# Altium project MAX96717_EVB_revC.PrjPcb
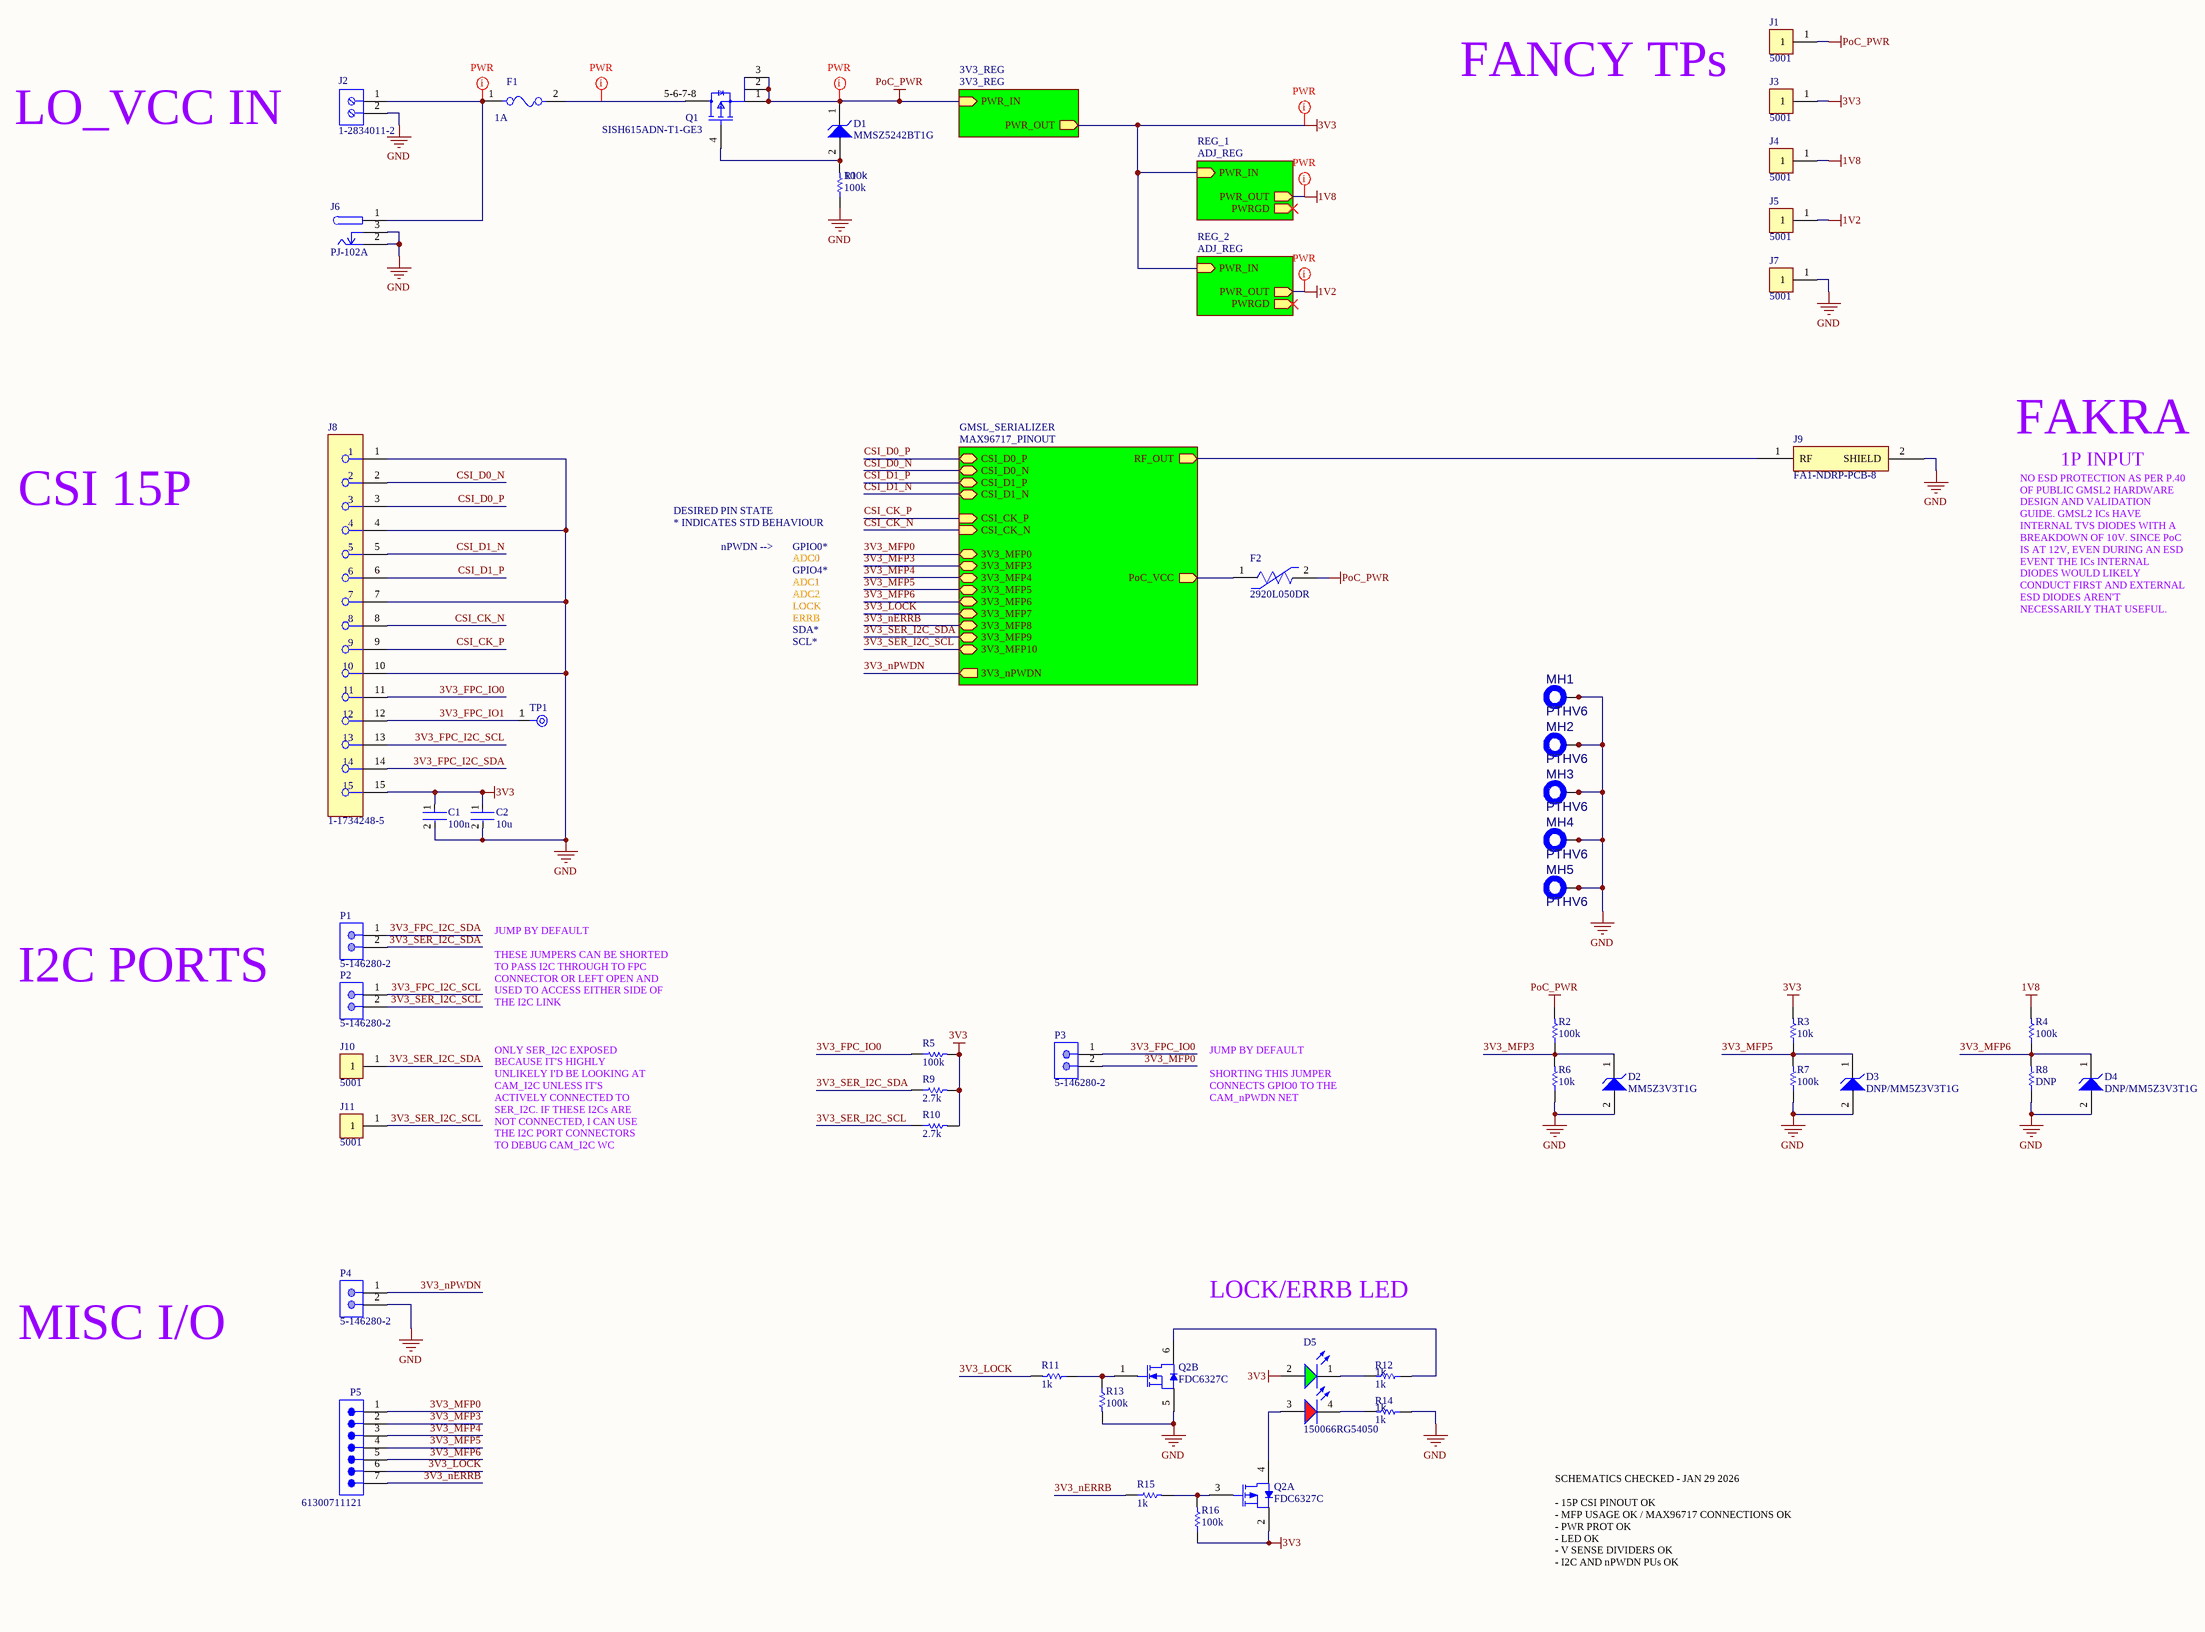
[diagram p0: MAX96717_EVB_revC.SchDoc]
4 sheets, 104 parts. Net scope: hierarchical (ports join the sheet entries above them; power ports are global).
Board file: MAX96717_EVB_revC.PcbDoc
Sheets:
  MAX96717_EVB_revC.SchDoc
    GMSL_SERIALIZER = MAX96717_PINOUT.SchDoc
    3V3_REG = 3V3_REG.SchDoc
    REG_1 = ADJ_REG.SchDoc
    REG_2 = ADJ_REG.SchDoc

## Sheet MAX96717_EVB_revC.SchDoc
size C; SheetNumber: 1; SheetTotal: 4

### Parts
C1  100n  [FP-0402-L_1_0_0_05-W_0_5-IPC_A]
C2  10u  [FP-0402-L_1_0_0_05-W_0_5-IPC_A]
D1  MMSZ5242BT1G  [ONSC-SOD-123-2-425-04_V]
D2  MM5Z3V3T1G  [ONSC-SOD-523-2-502-01_V]
D3  DNP/MM5Z3V3T1G  [ONSC-SOD-523-2-502-01_V]
D4  DNP/MM5Z3V3T1G  [ONSC-SOD-523-2-502-01_V]
D5  150066RG54050  [WL-SBCD_0606]
F1  1A  [FP-SF-1206FP-MFG]
F2  2920L050DR  [FP-2920L050DR-MFG]
J1  5001  [FP-5001-MFG]
J2  1-2834011-2  [1-2834011-2-Footprint-1]
J3  5001  [FP-5001-MFG]
J4  5001  [FP-5001-MFG]
J5  5001  [FP-5001-MFG]
J6  PJ-102A  [FP-PJ-102A-MFG]
J7  5001  [FP-5001-MFG]
J8  1-1734248-5  [FP-1-1734248-5-MFG]
J9  FA1-NDRP-PCB-8  [FA1-NDRP-PCB-8-Footprint-1]
J10  5001  [FP-5001-MFG]
J11  5001  [FP-5001-MFG]
MH1  PTHV6  [PTHV6 M2]  (net tie, no BOM)
MH2  PTHV6  [PTHV6 M2]  (net tie, no BOM)
MH3  PTHV6  [PTHV6 M2]  (net tie, no BOM)
MH4  PTHV6  [PTHV6 M2]  (net tie, no BOM)
MH5  PTHV6  [PTHV6 M2]  (net tie, no BOM)
P1  5-146280-2  [TECO-5-146280-2_V]
P2  5-146280-2  [TECO-5-146280-2_V]
P3  5-146280-2  [TECO-5-146280-2_V]
P4  5-146280-2  [TECO-5-146280-2_V]
P5  61300711121  [61300711121]
Q1  SISH615ADN-T1-GE3  [SISH615ADN-T1-GE3-Footprint-1]
Q2  FDC6327C  [FAIR-SOT23-6_V]  (parts A,B of 2)
R1  100k  [R0603B]
R2  100k  [R0603B]
R3  10k  [R0603B]
R4  100k  [R0603B]
R5  100k  [R0603B]
R6  10k  [R0603B]
R7  100k  [R0603B]
R8  DNP  [R0603B]
R9  2.7k  [R0603B]
R10  2.7k  [R0603B]
R11  1k  [R0603B]
R12  1k  [R0603B]
R13  100k  [R0603B]
R14  1k  [R0603B]
R15  1k  [R0603B]
R16  100k  [R0603B]
TP1  TPAD6R  [New footprint 1]  (value not drawn)  (no BOM)

### Sub-sheets
3V3_REG = 3V3_REG: PWR_IN (in), PWR_OUT (out)
GMSL_SERIALIZER = MAX96717_PINOUT: CSI_D0_P (bidir), CSI_D0_N (bidir), CSI_D1_P (bidir), CSI_D1_N (bidir), CSI_CK_P (in), CSI_CK_N (in), RF_OUT (out), PoC_VCC (out), 3V3_MFP0 (bidir), 3V3_MFP3 (bidir), 3V3_MFP4 (bidir), 3V3_MFP5 (bidir), 3V3_MFP6 (bidir), 3V3_MFP7 (bidir), 3V3_MFP8 (bidir), 3V3_MFP9 (bidir), 3V3_MFP10 (bidir), 3V3_nPWDN (out)
REG_1 = ADJ_REG: PWR_OUT (out), PWR_IN (in), PWRGD (out)
REG_2 = ADJ_REG: PWR_OUT (out), PWR_IN (in), PWRGD (out)

### Nets
1V2: J5.1 ; sheet REG_2/PWR_OUT
1V8: J4.1 R4.2 ; sheet REG_1/PWR_OUT
3V3: C1.1 C2.1 D5.2(A) J3.1 J8.15 Q2.2(S) R3.2 R5.2 R9.2 R10.2 R16.1 ; sheet 3V3_REG/PWR_OUT, sheet REG_1/PWR_IN, sheet REG_2/PWR_IN
GND: C1.2 C2.2 D2.2(A) D3.2(A) D4.2(A) J2.2 J6.2 J6.3 J7.1 J8.1 J8.4 J8.7 J8.10 J9.2(SHIELD) MH1.1(MH) MH1.2(V1) MH1.3(V2) MH1.4(V3) MH1.5(V4) MH1.6(V5) MH1.7(V6) MH2.1(MH) MH2.2(V1) MH2.3(V2) MH2.4(V3) MH2.5(V4) MH2.6(V5) MH2.7(V6) MH3.1(MH) MH3.2(V1) MH3.3(V2) MH3.4(V3) MH3.5(V4) MH3.6(V5) MH3.7(V6) MH4.1(MH) MH4.2(V1) MH4.3(V2) MH4.4(V3) MH4.5(V4) MH4.6(V5) MH4.7(V6) MH5.1(MH) MH5.2(V1) MH5.3(V2) MH5.4(V3) MH5.5(V4) MH5.6(V5) MH5.7(V6) P4.2 Q2.5(S) R1.1 R6.1 R7.1 R8.1 R13.2 R14.1
PoC_PWR: D1.1(K) F2.2 J1.1 Q1.1(S) Q1.2(S) Q1.3(S) R2.2 ; sheet 3V3_REG/PWR_IN
3V3_FPC_I2C_SCL: J8.13 P2.1
3V3_FPC_I2C_SDA: J8.14 P1.1
3V3_FPC_IO0: J8.11 P3.1 R5.1
3V3_FPC_IO1: J8.12 TP1.1(TP)
3V3_LOCK: P5.6 R11.2 ; sheet GMSL_SERIALIZER/3V3_MFP7
3V3_MFP0: P3.2 P5.1 ; sheet GMSL_SERIALIZER/3V3_MFP0
3V3_MFP3: D2.1(K) P5.2 R2.1 R6.2 ; sheet GMSL_SERIALIZER/3V3_MFP3
3V3_MFP4: P5.3 ; sheet GMSL_SERIALIZER/3V3_MFP4
3V3_MFP5: D3.1(K) P5.4 R3.1 R7.2 ; sheet GMSL_SERIALIZER/3V3_MFP5
3V3_MFP6: D4.1(K) P5.5 R4.1 R8.2 ; sheet GMSL_SERIALIZER/3V3_MFP6
3V3_nERRB: P5.7 R15.1 ; sheet GMSL_SERIALIZER/3V3_MFP8
3V3_nPWDN: P4.1 ; sheet GMSL_SERIALIZER/3V3_nPWDN
3V3_SER_I2C_SCL: J11.1 P2.2 R10.1 ; sheet GMSL_SERIALIZER/3V3_MFP10
3V3_SER_I2C_SDA: J10.1 P1.2 R9.1 ; sheet GMSL_SERIALIZER/3V3_MFP9
CSI_CK_N: J8.8 ; sheet GMSL_SERIALIZER/CSI_CK_N
CSI_CK_P: J8.9 ; sheet GMSL_SERIALIZER/CSI_CK_P
CSI_D0_N: J8.2 ; sheet GMSL_SERIALIZER/CSI_D0_N
CSI_D0_P: J8.3 ; sheet GMSL_SERIALIZER/CSI_D0_P
CSI_D1_N: J8.5 ; sheet GMSL_SERIALIZER/CSI_D1_N
CSI_D1_P: J8.6 ; sheet GMSL_SERIALIZER/CSI_D1_P
RF_OUT: J9.1(RF) ; sheet GMSL_SERIALIZER/RF_OUT
NetD1_2: D1.2(A) Q1.4(G) R1.2
NetD5_1: D5.1(K) R12.2
NetD5_3: D5.3(A) Q2.4(D)
NetD5_4: D5.4(K) R14.2
NetF1_1: F1.1 J2.1 J6.1
NetF1_2: F1.2 Q1.5-6-7-8(D)
NetF2_1: F2.1 ; sheet GMSL_SERIALIZER/PoC_VCC
NetQ2_1: Q2.1(G) R11.1 R13.1
NetQ2_3: Q2.3(G) R15.2 R16.2
NetQ2_6: Q2.6(D) R12.1

### Layout directives
net class PWR: 1V2, 1V8, 3V3, NetF1_1, NetF1_2, PoC_PWR

### Notes on the sheet
- FANCY TPs
- LO_VCC IN
- FAKRA
- 1P INPUT
- CSI 15P
- DESIRED PIN STATE
- * INDICATES STD BEHAVIOUR
- nPWDN -->
- GPIO0*
- ADC0
- GPIO4*
- ADC1
- ADC2
- LOCK
- ERRB
- SDA*
- SCL*
- NO ESD PROTECTION AS PER P.40 OF PUBLIC GMSL2 HARDWARE DESIGN AND VALIDATION GUIDE. GMSL2 ICs HAVE INTERNAL TVS DIODES WITH A BREAKDOWN OF 10V. SINCE PoC IS AT 12V, EVEN DURING AN ESD EVENT THE ICs INTERNAL DIODES WOULD LIKELY CONDUCT FIRST AND EXTERNAL ESD DIODES AREN'T NECESSARILY THAT USEFUL.
- I2C PORTS
- JUMP BY DEFAULT
  THESE JUMPERS CAN BE SHORTED TO PASS I2C THROUGH TO FPC CONNECTOR OR LEFT OPEN AND USED TO ACCESS EITHER SIDE OF THE I2C LINK
- JUMP BY DEFAULT
  SHORTING THIS JUMPER CONNECTS GPIO0 TO THE CAM_nPWDN NET
- ONLY SER_I2C EXPOSED BECAUSE IT'S HIGHLY UNLIKELY I'D BE LOOKING AT CAM_I2C UNLESS IT'S ACTIVELY CONNECTED TO SER_I2C. IF THESE I2Cs ARE NOT CONNECTED, I CAN USE THE I2C PORT CONNECTORS TO DEBUG CAM_I2C WC
- LOCK/ERRB LED
- MISC I/O
- SCHEMATICS CHECKED - JAN 29 2026
  - 15P CSI PINOUT OK
  - MFP USAGE OK / MAX96717 CONNECTIONS OK
  - PWR PROT OK
  - LED OK
  - V SENSE DIVIDERS OK
  - I2C AND nPWDN PUs OK

### Library data of the parts
C1 C2 = CMP-001-00058-1: LARGE PADS, 0402 CAP, CHANGE COMMENT TO MATCH REAL P/N; Capacitor Type: Ceramic; Min Operating Temperature: -55°C; Mounting Technology: Surface Mount; Pins: 2; Case/Package: 0402; RoHS Compliant: Yes; Max Operating Temperature: 85°C
D1 = CMP-1060-00565-1: Zener Voltage Regulator, 500 mW, 2-Pin SOD-123, Pb-Free, Tape and Reel; Manufacturer: On Semiconductor; P Max (W): 0.5; VZ Typ (V): 12; PartNumber: MMSZ5242BT1G; PackageReference: SOD-123-2-425-04; ComponentLink3URL: http://www.onsemi.com/pub_link/Collateral/425-04.PDF; Mounting Technology: Surface Mount; ComponentLink2Description: Datasheet; ComponentLink1URL: http://www.onsemi.com/; ComponentLink3Description: Package Specification; PackageDescription: 2-Pin SOD, Body 1.6 x 2.69 mm; PackageVersion: Rev. G, 10/2009; ComponentLink1Description: Manufacturer URL; RoHS: Pb-Free; ComponentLink2URL: http://www.onsemi.com/pub_link/Collateral/MMSZ5221BT1-D.PDF; Packing: Tape and Reel; DatasheetVersion: Rev. 12
D2-D4 = CMP-1060-00750-1: Zener Voltage Regulator, 500 mW, 2-Pin SOD-523, Pb-Free, Tape and Reel; Manufacturer: On Semiconductor; P Max (W): 0.5; VZ Typ (V): 3.3; RoHS: Pb-Free; ComponentLink2Description: Datasheet; PackageReference: SOD-523-2-502-01; DatasheetVersion: Rev. 10; ComponentLink1Description: Manufacturer URL; PackageVersion: Rev. E, 09/2010; ComponentLink3URL: http://www.onsemi.com/pub_link/Collateral/502-01.PDF; ComponentLink2URL: http://www.onsemi.cn/pub_link/Collateral/MM5Z2V4T1-D.PDF; Mounting Technology: Surface Mount; PartNumber: MM5Z3V3T1G; Packing: Tape and Reel; PackageDescription: 2-Pin SOD, Body 1.2 x 0.8 mm; ComponentLink1URL: http://www.onsemi.com/; ComponentLink3Description: Package Specification
D5 = CMP-004-00040-2: Led, Red/Grn, 180Mcd/230Mcd, 624Nm/525Nm Rohs Compliant: Yes; Source: rgled.SchLib; Component Type: Standard; Design Item ID: CMP-004-00034-2; Pins: 4
F1 = CMP-07399-000013-1: FUSE BOARD MOUNT 2A 63VDC 1206; Voltage Rating (DC): 63V; Fuse Type: Board Mount (Cartridge Style Excluded); Approvals: UL; Mount: Surface Mount; Min Operating Temperature: -20°C; Max Operating Temperature: 105°C; Case Code (Imperial): 1206; Packaging: Cut Tape; Current Rating: 2A; RoHS Compliant: Yes; Series: SinglFuse™ SF-1206FP; Case Code (Metric): 3216; Case/Package: 1206
F2 = CMP-08606-000071-1: PTC RESET FUSE 60V 500MA 2920; Resistance: 1.4R; Trip Current: 1A; Power Dissipation: 1.5W; Time to Trip: 4s; Approvals: cULus; Current Rating: 10A; Operating Supply Voltage: 60V; Termination: SMD/SMT; Width: 5.44mm; Case/Package: 2920; Series: 2920L; Case Code (Imperial): 2920; Height: 1.25mm; Hold Current: 500mA; Terminal Material: Copper; Min Operating Temperature: -40°C; Package Quantity: 1500; Max Voltage Rating (DC): 60V; RoHS Compliant: Yes; Case Code (Metric): 7351; Lead Free: Lead Free; Max Operating Temperature: 85°C; Voltage Rating (DC): 60V; Working Voltage: 60V; Length: 7.98mm; REACH SVHC: No SVHC; Max Current Rating: 10A; Voltage Rating: 60V; Packaging: Tape and Reel
J1 J3-J5 J7 J10 J11 = CMP-2000-05181-2: PC TEST POINT MINIATURE BLACK; Body Material: Bronze; Plating: Silver; Inside Diameter: 1.27mm; Hole Diameter: 1.6mm; Number of Ports: 1; Outside Diameter: 2.54mm; Insulation: Insulated; Insulation Material: Nylon; Mount: Through Hole; RoHS Compliant: Yes; Series: THM; Height: 0.3inch; Termination: Through Hole; Material: Nylon; Packaging: Bulk; Contact Material: Bronze; REACH SVHC: No SVHC; Contact Plating: Silver; Orientation: Straight; Lead Free: Lead Free; Package Quantity: 100; Length: 7.62mm; Flammability Rating: UL94 V-0; Number of Contacts: 1; Diameter: 2.54mm; Housing Color: Black; Color: Black
J2 = CMP-002-00067-1: Barrier Strip Terminal Block; RoHS Compliant: Yes
J6 = CMP-12637-106234071-1: PJ-102A 2.0 x 6.5 mm, 2.5 A, Horizontal, Through Hole, Tapered Pins, Dc Power Jack Connector; Voltage Rating (DC): 24V; Number of Contacts: 3; Outside Diameter: 6.5mm; Gender: Male; Shielding: No; Insulation Resistance: 50MΩ; Current Rating: 2.5A; Inside Diameter: 2mm; Number of Conductors: 2; Housing Color: Black; RoHS: Compliant; Diameter: 2.1mm; Mount: Through Hole; Contact Plating: Nickel; NexarPartId: 106234071; Voltage Rating: 24V; Housing Material: Thermoplastic; Max Operating Temperature: 85°C; Color: Black; Contact Material: Copper, Nickel, Tin; Orientation: Horizontal; Packaging: Bulk; Flammability Rating: UL94 V-0; Schedule B: 8536695050, 8536695050; Contact Gender: Male; Lead Free: Lead Free; Termination: Through Hole; Min Operating Temperature: -25°C; Height: 11.2mm; Lifecycle Status: Production
J8 = CMP-03368-000001-1: CONN FPC VERT 15POS 1.00MM SMD; Manufacturer: TE; Conn Orientation: Vertical; Conn Gender: Female; Current Rating: 1A; Is Female: yes; Number Of Contacts: 15; Pitch: 1mm; Voltage Rating: 125V; ComponentLink2URL: https://www.te.com/commerce/DocumentDelivery/DDEController?Action=showdoc&DocId=Customer+Drawing%7F1734248%7FE1%7Fpdf%7FEnglish%7FENG_CD_1734248_E1__.pdf%7F1-1734248-5; Device Class L1: Connectors; Category: Conn; Package: 0; Lead Free: Yes; Digikey Description: CONN FPC VERT 15POS 1.00MM SMD; Height: 8mm; Manufacturer Part Number: 1-1734248-5; Temperature: -20°C to +85°C; Contact Material: Gold,Nickel; Device Class L3: unset; ComponentLink2Description: Datasheet; RoHS: TRUE; Temperature Range Low: -20°C; Octopart: https://octopart.com/1-1734248-5-te+connectivity-40620898; Device Class L2: FFC / FPC; Mouser Description: FFC & FPC Connectors 15P 1.0 FPC, Zip V/T SMT; Automotive: No; Temperature Range High: +85°C; Mounting Type: Surface Mount
J9 = CMP-002-00054-2: RF F Connector, Male, Board Mount, Solder Terminal, Plug; Connector Type: RF F CONNECTOR; RoHS Compliant: Yes; Mounting Technology: Board
MH1-MH5 = CMP-00028-00001-13: Plated mounting hole with 6 peripheral vias. This is a generic symbol that groups all relevant footprints.
P1-P4 = CMP-2000-07492-1: Male Header, Pitch 2.54 mm, 1 x 2 Position, Height 8.21 mm, Tail Length 3.05 mm, -65 to 105 degC, RoHS, Bulk; Manufacturer: TE Connectivity; Mating Connector Lock: No(Without); Number of Positions: 2; Pitch: 2.54mm; PCB Mounting Orientation: Vertical; Keyed: No; Case\/Package: 100; Mating Post Length: 0.23inch; High Temperature Housing: Yes; Max Current Rating: 5A; PCB Thickness: 0.063inch; PCB Mount Retention: Without; Approvals: CSA; Current Rating: 3A; Radiation Hardening: No; Length: 4.67mm; Contact Mating Length: 0.23inch; Connector Type: Header; Number of Rows: 1; Termination Post Length: 0.12inch; Board Standoff: No(Without); Max Operating Temperature: 105degC; Contact Shape: Square; Selectively Loaded: No(Without); Gasket: No(Without); Number of Contacts: 2; Contact Gender: Male; Mating Alignment: No(Without); Manufacturer URL: http://www.te.com/; Datasheet URL: http://www.te.com/commerce/DocumentDelivery/DDEController?Action=showdoc&DocId=Customer+Drawing%7F146280%7FH1%7Fpdf%7FEnglish%7FENG_CD_146280_H1.pdf%7F5-146280-2; Mount: ThroughHole; Orientation: Straight; Packaging: Carton; Package Reference: 5-146280-2; Package Quantity: 500; Stabilizers: No(Without); Row Spacing: 2.54mm; Contact Material: CopperAlloy; Panel Mount Retention: No(Without); Datasheet Version: Rev. H1, 08/2016; Housing Colour: Black; Colour: Black; Package Description: Male Header, Pitch 2.54 mm, 1 x 2 Position, Height 8.21 mm, Tail Length 3.05 mm; Contact Plating: Matte; Housing Material: Polymer; Contact Protection: No(Without); Min Operating Temperature: -65degC; Mounting Technology: ThroughHole; Flammability Rating: UL94V-0; RoHSCompliant: true; Termination: ThroughHole; Depth: 2.34mm; High Speed Serial Data Connector: No
P5 = CMP-1502-01074-4: THT Vertical Pin Header WR-PHD, Pitch 2.54 mm, Single Row, 7 pins; Number of Positions: 7; Pitch: 2.54mm; Gender: Male; Operating Supply Voltage: 250V; Contact Resistance: 20mΩ; Current Rating: 3A; Connector Type: Male Pin; Contact Mating Length: 5.9944mm; Number of Rows: 1; Packaging: Bulk; Contact Material: Copper; Orientation: Vertical; Color: Black; Mount: Through Hole; Termination: Solder; RoHS: Compliant; Lead Pitch: 2.54mm; Contact Plating: Gold; Number of Pins: 7; Number of Contacts: 7
Q1 = CMP-013-00018-2: Trans MOSFET P-CH 20V 22.1A 8-Pin PowerPAK 1212 EP T/R; Source: SISH615ADN-T1-GE3.SchLib; Design Item ID: CMP-013-00036-4; Component Type: Standard; Pins: 5
Q2 = CMP-2000-04939-1: Dual N & P-Channel 2.5 V Specified PowerTrench(TM) MOSFET, -55 to 150 degC, 6-Pin SOT-23, RoHS, Tape and Reel; Manufacturer: Fairchild; Typical Rise Time: 9@NChannel; Rad Hard: No; Maximum Drain Source Voltage: 20V; Typical Fall Time: 3@NChannel; Typical Turn-On Delay Time: 5@NChannel; Maximum Continuous Drain Current: 2.7@NChannel; Typical Turn-Off Delay Time: 12@NChannel; RDS-on: 80@4.5V@NChannel; Channel Mode: Enhancement; Maximum Gate Source Voltage: ±8V; Package Version: Rev. 5, 05/2015; Operating Temperature: -55to150degC; Packaging: Tape&Reel; Package Reference: SOT23-6; Package URL: https://www.fairchildsemi.com/package-drawings/MA/MA06A.pdf; Package Description: 6-Pin Small Outline Transistor, Body 2.9 x 1.6 mm, Pitch 0.95 mm; Manufacturer URL: https://www.fairchildsemi.com/; Channel Type: N; Datasheet Version: Rev. E, 07/2000; Package: 6SuperSOT; Datasheet URL: https://www.fairchildsemi.com/datasheets/FD/FDC6327C.pdf; Mounting: SurfaceMount; Category: MOSFET
R1 R2 R4 R5 R7 R11-R16 = CMP-009-00002-14: Resistor
  R1 R2 R4 R5 R7: Value: 100k
  R12 R14: Value: 1k
R3 R6 R8-R10 = CMP-009-00002-14: Resistor; Value: 100k
TP1 = CMP-00025-3: Test Point .6mm

## Sheet MAX96717_PINOUT.SchDoc
size C; SheetNumber: 4; SheetTotal: 4
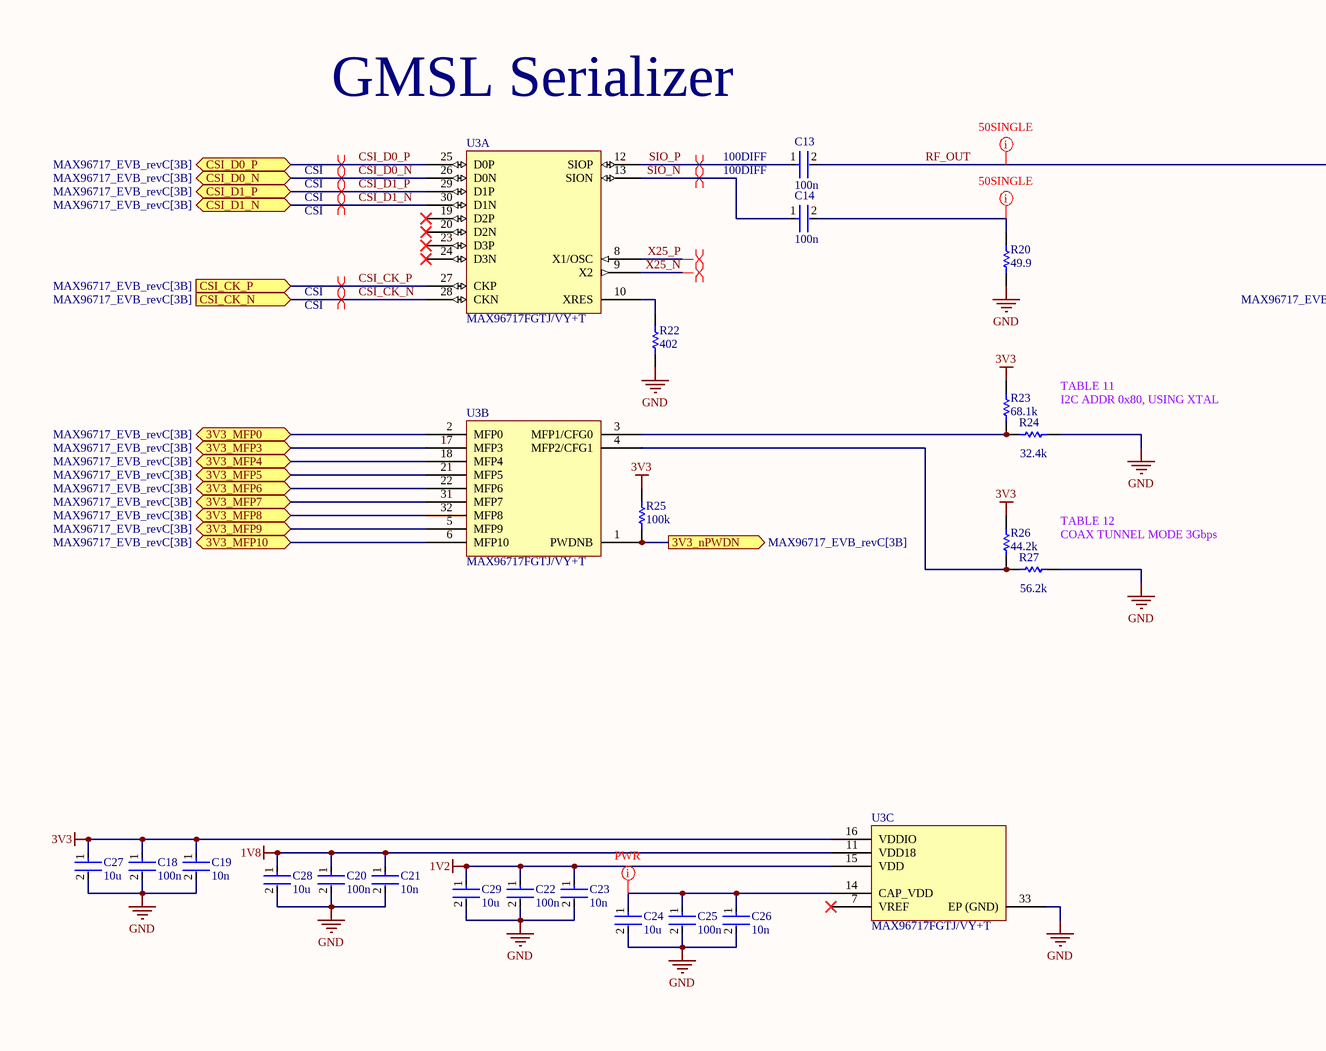
[diagram p1: MAX96717_PINOUT.SchDoc, left]
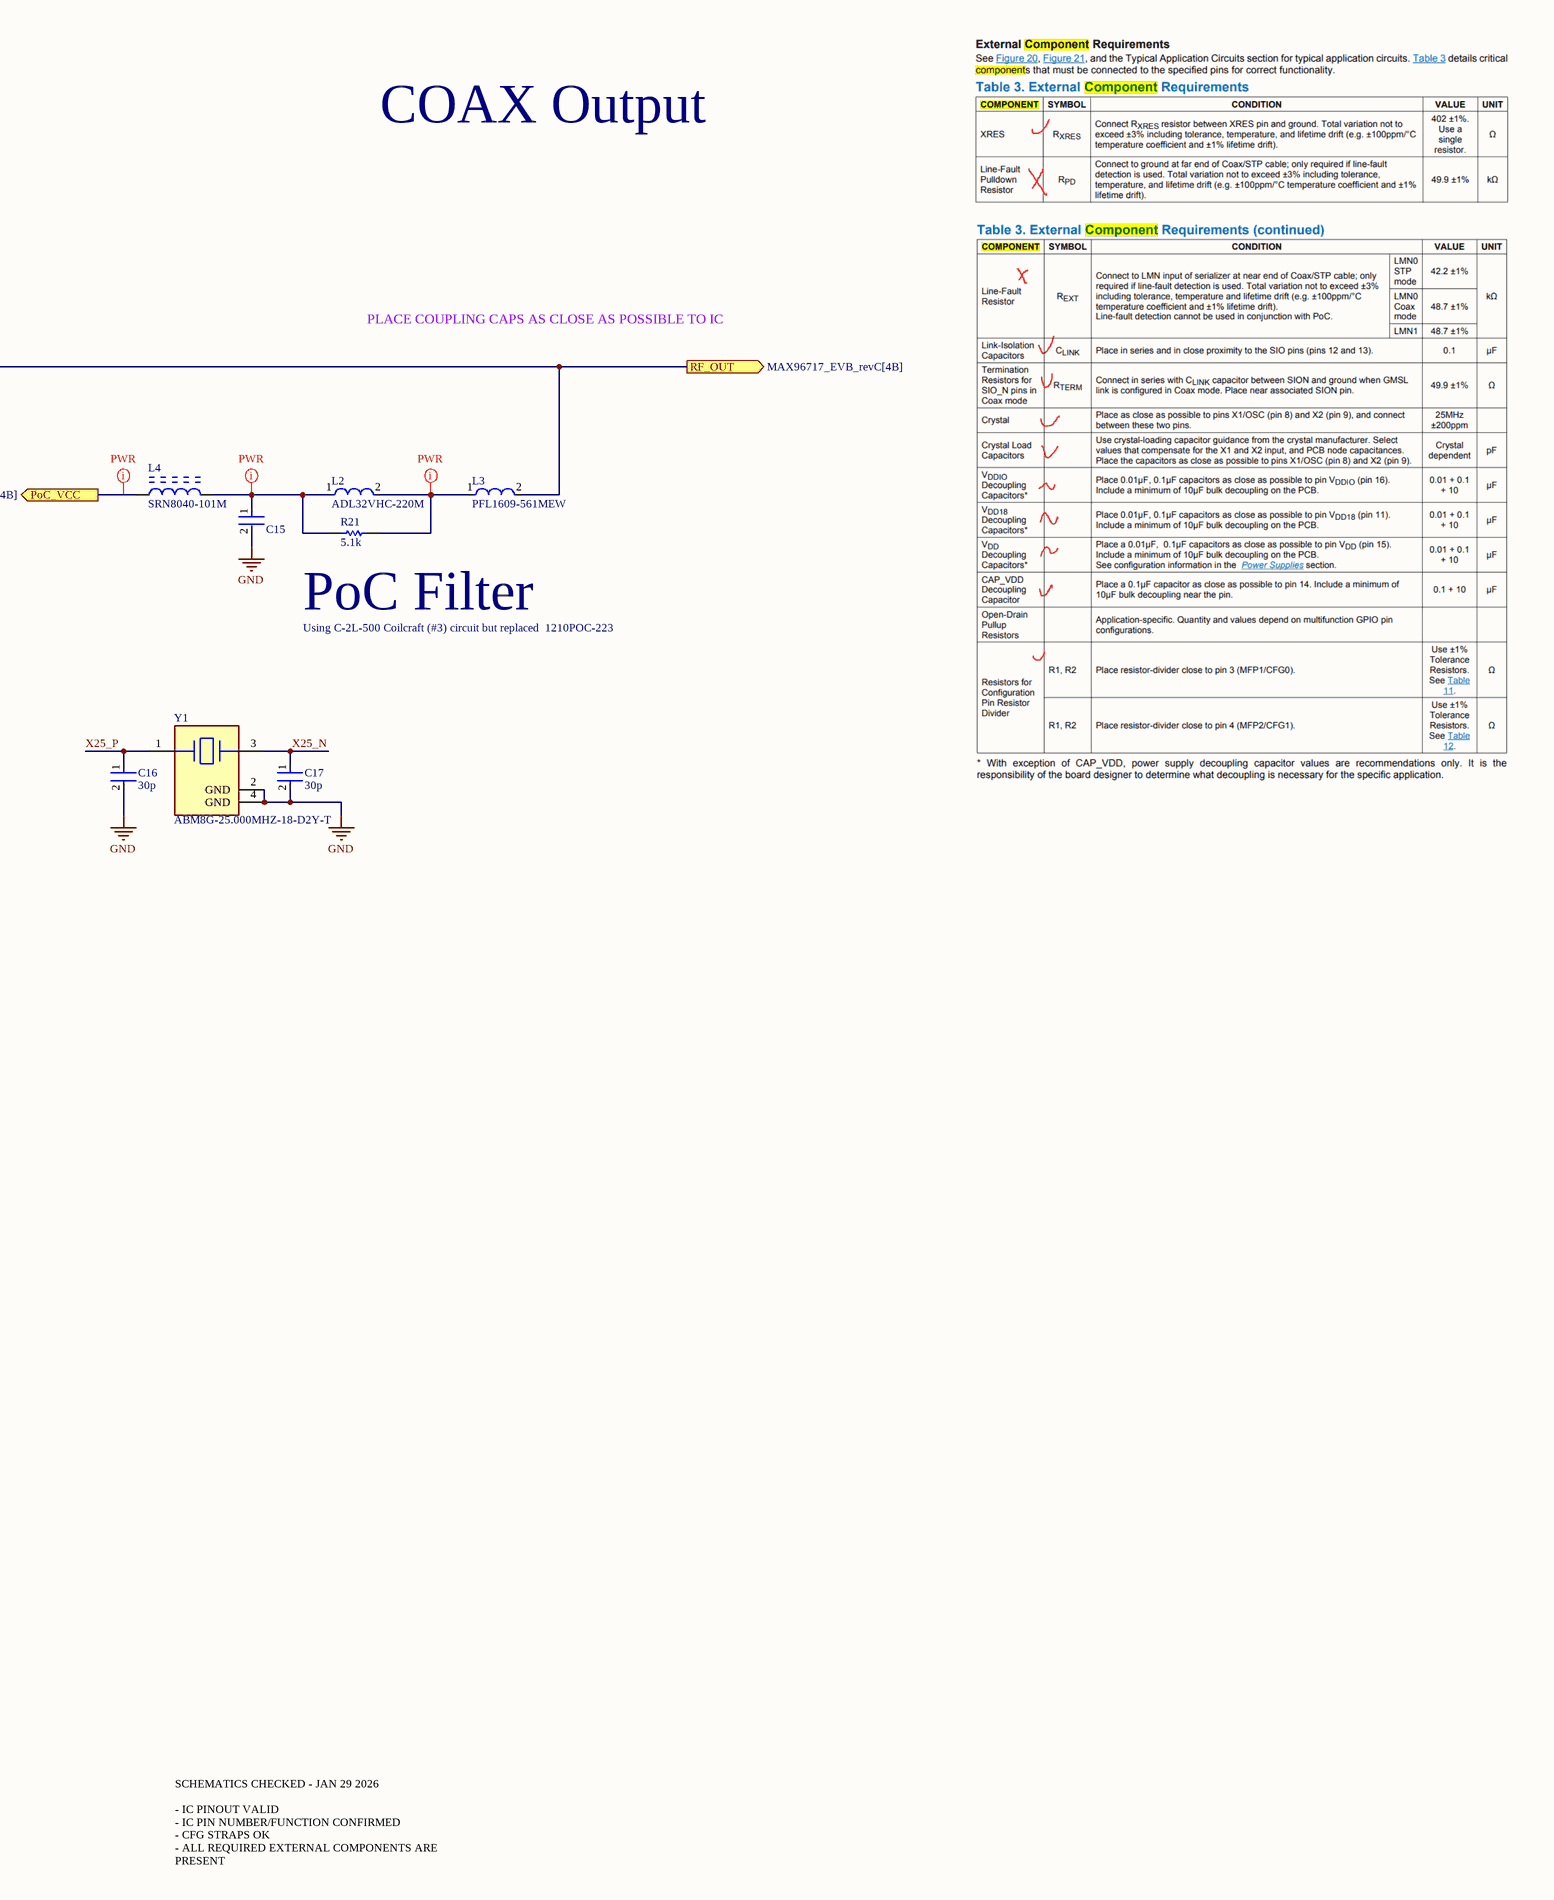
[diagram p2: MAX96717_PINOUT.SchDoc, right]

### Parts
C13  100n  [FP-0402-L_1_0_0_05-W_0_5-IPC_A]
C14  100n  [FP-0402-L_1_0_0_05-W_0_5-IPC_A]
C15  GRM21BR61E226ME44L  [FP-GRM21B-0_2-e0_2_0_7-IPC_B]  (value not drawn)
C16  30p  [FP-0402-L_1_0_0_05-W_0_5-IPC_A]
C17  30p  [FP-0402-L_1_0_0_05-W_0_5-IPC_A]
C18  100n  [FP-0402-L_1_0_0_05-W_0_5-IPC_A]
C19  10n  [FP-0402-L_1_0_0_05-W_0_5-IPC_A]
C20  100n  [FP-0402-L_1_0_0_05-W_0_5-IPC_A]
C21  10n  [FP-0402-L_1_0_0_05-W_0_5-IPC_A]
C22  100n  [FP-0402-L_1_0_0_05-W_0_5-IPC_A]
C23  10n  [FP-0402-L_1_0_0_05-W_0_5-IPC_A]
C24  10u  [FP-0402-L_1_0_0_05-W_0_5-IPC_A]
C25  100n  [FP-0402-L_1_0_0_05-W_0_5-IPC_A]
C26  10n  [FP-0402-L_1_0_0_05-W_0_5-IPC_A]
C27  10u  [FP-0402-L_1_0_0_05-W_0_5-IPC_A]
C28  10u  [FP-0402-L_1_0_0_05-W_0_5-IPC_A]
C29  10u  [FP-0402-L_1_0_0_05-W_0_5-IPC_A]
L2  ADL32VHC-220M  [FP-1210POC-MFG]
L3  PFL1609-561MEW  [FP-PFL1609-MFG]
L4  SRN8040-101M  [BOUR-SRN8040-101M_V]
R20  49.9  [R0603B]
R21  5.1k  [R0603B]
R22  402  [R0603B]
R23  68.1k  [R0603B]
R24  32.4k  [R0603B]
R25  100k  [R0603B]
R26  44.2k  [R0603B]
R27  56.2k  [R0603B]
U3  MAX96717FGTJ/VY+T  [QFN50P500X500X80_HS-33N]  (parts A,B,C of 3)
Y1  ABM8G-25.000MHZ-18-D2Y-T  [FP-ABM8G-MFG]

### Ports
3V3_MFP0 (bidir, see MAX96717_EVB_revC[3B]), 3V3_MFP3 (bidir, see MAX96717_EVB_revC[3B]), 3V3_MFP4 (bidir, see MAX96717_EVB_revC[3B]), 3V3_MFP5 (bidir, see MAX96717_EVB_revC[3B]), 3V3_MFP6 (bidir, see MAX96717_EVB_revC[3B]), 3V3_MFP7 (bidir, see MAX96717_EVB_revC[3B]), 3V3_MFP8 (bidir, see MAX96717_EVB_revC[3B]), 3V3_MFP9 (bidir, see MAX96717_EVB_revC[3B]), 3V3_MFP10 (bidir, see MAX96717_EVB_revC[3B]), 3V3_nPWDN (out, see MAX96717_EVB_revC[3B]), CSI_CK_N (in, see MAX96717_EVB_revC[3B]), CSI_CK_P (in, see MAX96717_EVB_revC[3B]), CSI_D0_N (bidir, see MAX96717_EVB_revC[3B]), CSI_D0_P (bidir, see MAX96717_EVB_revC[3B]), CSI_D1_N (bidir, see MAX96717_EVB_revC[3B]), CSI_D1_P (bidir, see MAX96717_EVB_revC[3B]), PoC_VCC (out, see MAX96717_EVB_revC[4B]), RF_OUT (out, see MAX96717_EVB_revC[4B])

### Nets
1V2: C22.1 C23.1 C29.1 U3.15(VDD)
1V8: C20.1 C21.1 C28.1 U3.11(VDD18)
3V3: C18.1 C19.1 C27.1 R23.2 R25.2 R26.2 U3.16(VDDIO)
GND: C15.2 C16.2 C17.2 C18.2 C19.2 C20.2 C21.2 C22.2 C23.2 C24.2 C25.2 C26.2 C27.2 C28.2 C29.2 R20.1 R22.1 R24.1 R27.1 U3.33(EP_(GND)) Y1.2(GND) Y1.4(GND)
3V3_LOCK: U3.31(MFP7) ; port 3V3_MFP7
3V3_MFP0: U3.2(MFP0) ; port 3V3_MFP0
3V3_MFP3: U3.17(MFP3) ; port 3V3_MFP3
3V3_MFP4: U3.18(MFP4) ; port 3V3_MFP4
3V3_MFP5: U3.21(MFP5) ; port 3V3_MFP5
3V3_MFP6: U3.22(MFP6) ; port 3V3_MFP6
3V3_nERRB: U3.32(MFP8) ; port 3V3_MFP8
3V3_nPWDN: R25.1 U3.1(PWDNB) ; port 3V3_nPWDN
3V3_SER_I2C_SCL: U3.6(MFP10) ; port 3V3_MFP10
3V3_SER_I2C_SDA: U3.5(MFP9) ; port 3V3_MFP9
CSI_CK_N: U3.28(CKN) ; port CSI_CK_N
CSI_CK_P: U3.27(CKP) ; port CSI_CK_P
CSI_D0_N: U3.26(D0N) ; port CSI_D0_N
CSI_D0_P: U3.25(D0P) ; port CSI_D0_P
CSI_D1_N: U3.30(D1N) ; port CSI_D1_N
CSI_D1_P: U3.29(D1P) ; port CSI_D1_P
RF_OUT: C13.2 L3.2 ; port RF_OUT
SIO_N: C14.1 U3.13(SION)
SIO_P: C13.1 U3.12(SIOP)
X25_N: C17.1 U3.9(X2) Y1.3
X25_P: C16.1 U3.8(X1/OSC) Y1.1
NetC14_2: C14.2 R20.2
NetC15_1: C15.1 L2.1 L4.2 R21.2
NetC24_1: C24.1 C25.1 C26.1 U3.14(CAP_VDD)
NetF2_1: L4.1 ; port PoC_VCC
NetL2_2: L2.2 L3.1 R21.1
NetR22_2: R22.2 U3.10(XRES)
NetR23_1: R23.1 R24.2 U3.3(MFP1/CFG0)
NetR26_1: R26.1 R27.2 U3.4(MFP2/CFG1)

Not connected (* = marked no-connect by the designer): U3 7(VREF)* 19(D2P)* 20(D2N)* 23(D3P)* 24(D3N)*

### Layout directives
differential pair: X25_N, X25_P
differential pair; differential pair class CSI: CSI_CK_N, CSI_CK_P, CSI_D0_N, CSI_D0_P, CSI_D1_N, CSI_D1_P
differential pair; differential pair class 100DIFF: SIO_N, SIO_P
net class PWR: NetC15_1, NetC24_1, NetF2_1, NetL2_2
net class 50SINGLE: NetC14_2, RF_OUT

### Notes on the sheet
- COAX Output
- GMSL Serializer
- PLACE COUPLING CAPS AS CLOSE AS POSSIBLE TO IC
- TABLE 11
- (near R24) I2C ADDR 0x80, USING XTAL
- Using C-2L-500 Coilcraft (#3) circuit but replaced  1210POC-223
- (near R21) PoC Filter
- TABLE 12
- (near R27) COAX TUNNEL MODE 3Gbps
- SCHEMATICS CHECKED - JAN 29 2026
  - IC PINOUT VALID
  - IC PIN NUMBER/FUNCTION CONFIRMED
  - CFG STRAPS OK
  - ALL REQUIRED EXTERNAL COMPONENTS ARE PRESENT

### Library data of the parts
C13 C14 C16-C29 = CMP-001-00058-1: as C1 on sheet MAX96717_EVB_revC; Min Operating Temperature: -55°C; Mounting Technology: Surface Mount; Pins: 2; Case/Package: 0402; RoHS Compliant: Yes; Max Operating Temperature: 85°C
C15 = CMP-2007-03222-3: Chip Multilayer Ceramic Capacitors for General Purpose, 0805, 22uF, X5R, 15%, 20%, 25V; Case/Package: 0805; Depth: 1.25mm; Resistor Type: Ceramic; Voltage Rating: 25V; Lead Free: Lead Free; Voltage Rating (DC): 25V; Case Code (Metric): 2012; Thickness: 0.057inch; REACH SVHC: No SVHC; Material: Ceramic; Tolerance: 20%; Length: 2mm; Capacitance: 22uF; Case Code (Imperial): 0805; Max Operating Temperature: 85°C; Termination: SMD/SMT; Weight: 0.000335oz; Dielectric: X5R; Packaging: Tape and Reel; Voltage: 25V; Package Quantity: 3000; Height: 1.25mm; Mount: Surface Mount; Width: 1.25mm; Min Operating Temperature: -55°C
L2 = CMP-11268-000041-1: NOT COILCRAFT - ACTUAL P# --> ADL32VHC-220M / - Power Injection Chokes for PoC; Manufacturer Part Number: 1210POC-223MRC; Value: 22uH; Core Material: Ferrite; Saturation Current: 720mA; Series Resistance: 0.88Ω; Rms Current: 700mA; Automotive Grade: Grade 1; Self Resonant Frequency: 70MHz; Test Frequency: 100kHz; Tolerance: 20%; Ambient Temperature Range High: +125°C; Manufacturer: coilcraft; Octopart: https://octopart.com/1210poc-223mrc-coilcraft-103207315; Category: Ind; Device Class L2: Inductors; RoHS: TRUE; Device Class L3: Fixed Inductors; Package: 1210POC; Ambient Temperature Range Low: -40°C; ComponentLink2URL: https://drive.google.com/open?id=15FlOq8Y4YbRFohfA_cJ40jgnqs8va2Mh; Lead Free: Yes; Inductance: 22uH; Device Class L1: Passive Components; ComponentLink2Description: Datasheet; Automotive: Yes; Height: 3mm
L3 = CMP-11268-000007-1: Fixed Inductors PFL1609 Low Profile 0.56 uH 20 % 1.4 A; Manufacturer: coilcraft; Rms Current: 1100mA; Self Resonant Frequency: 600MHz; Core Material: Composite; Tolerance: 20%; Value: 0.56uH; Automotive Grade: Grade 1; Saturation Current: 710mA; Test Frequency: 7.9MHz; Shielding: true; Series Resistance: 130mΩ; Lead Free: Yes; Device Class L1: Passive Components; Package: PFL1609; Octopart: https://octopart.com/pfl1609-561mew-coilcraft-20329171; ComponentLink2URL: https://www.coilcraft.com/pdfs/pfl1609.pdf; Manufacturer Part Number: PFL1609-561MEW; Ambient Temperature Range Low: -40°C; Composition: Wirewound; Inductance: 0.56uH; Device Class L2: Inductors; Category: Ind; Device Class L3: Fixed Inductors; Mouser Description: Fixed Inductors PFL1609 Low Profile 0.56 uH 20 % 1.4 A; Automotive: Yes; ComponentLink2Description: Datasheet; Ambient Temperature Range High: +105°C; Height: 0.95mm; RoHS: TRUE
L4 = CMP-2000-07143-1: Semi-Shielded Power Inductor, 100 uH, -40 to 125 degC, 2-Pin SMD, RoHS, Tape and Reel; Manufacturer: Bourns; Tolerance: ±20 / %; Brand/Series: SRN8040Series; Current, Rating: 1 / A; Inductance: 100 / µH; Manufacturer URL: http://www.bourns.com/; Package Description: 2-Pin Surface Mount Device, Body 8 x 8 mm; Datasheet URL: http://www.produktinfo.conrad.com/datenblaetter/1000000-1099999/001056456-da-01-en-MAG_ABG_LEIST_IND_SRN8040_101M_100UH_SMD.pdf; Datasheet Version: 08/2013; Termination: SMT; Type: Power; Mounting Technology: SurfaceMount; Package Reference: SRN8040-101M
R20-R24 R26 R27 = CMP-009-00002-14: Resistor; Value: 100k
R25 = CMP-009-00002-14: Resistor; Value: 100k
U3 = CMP-015-00012-2: 3Gbps Serializer TQFN-32 Serializers / Deserializers ROHS
Y1 = CMP-2000-05733-3: Crystal 25MHz ±20ppm (Tol) ±30ppm (Stability) 18pF FUND 60Ω 4-Pin SMD T/R; Series Resistance: 60R; Length: 3.2mm; Depth: 2.5mm; Packaging: Tape and Reel; Min Operating Temperature: -40°C; Operating Frequency: 25 MHz; Lead Free: Lead Free; Number of Pins: 4; Frequency Tolerance: 20ppm; Radiation Hardening: No; Max Operating Temperature: 85°C; Termination: SMD/SMT; Frequency Stability: 30ppm; Frequency: 25MHz; Series: ABM8G; Mount: Surface Mount; Package Quantity: 1000; Height: 0.039inch; Width: 0.098inch; Case/Package: CSMD; ESR (Equivalent Series Resistance): 60R; Load Capacitance: 18pF; Tolerance: 20ppm

## Sheet 3V3_REG.SchDoc
size A; SheetNumber: 2; SheetTotal: 4
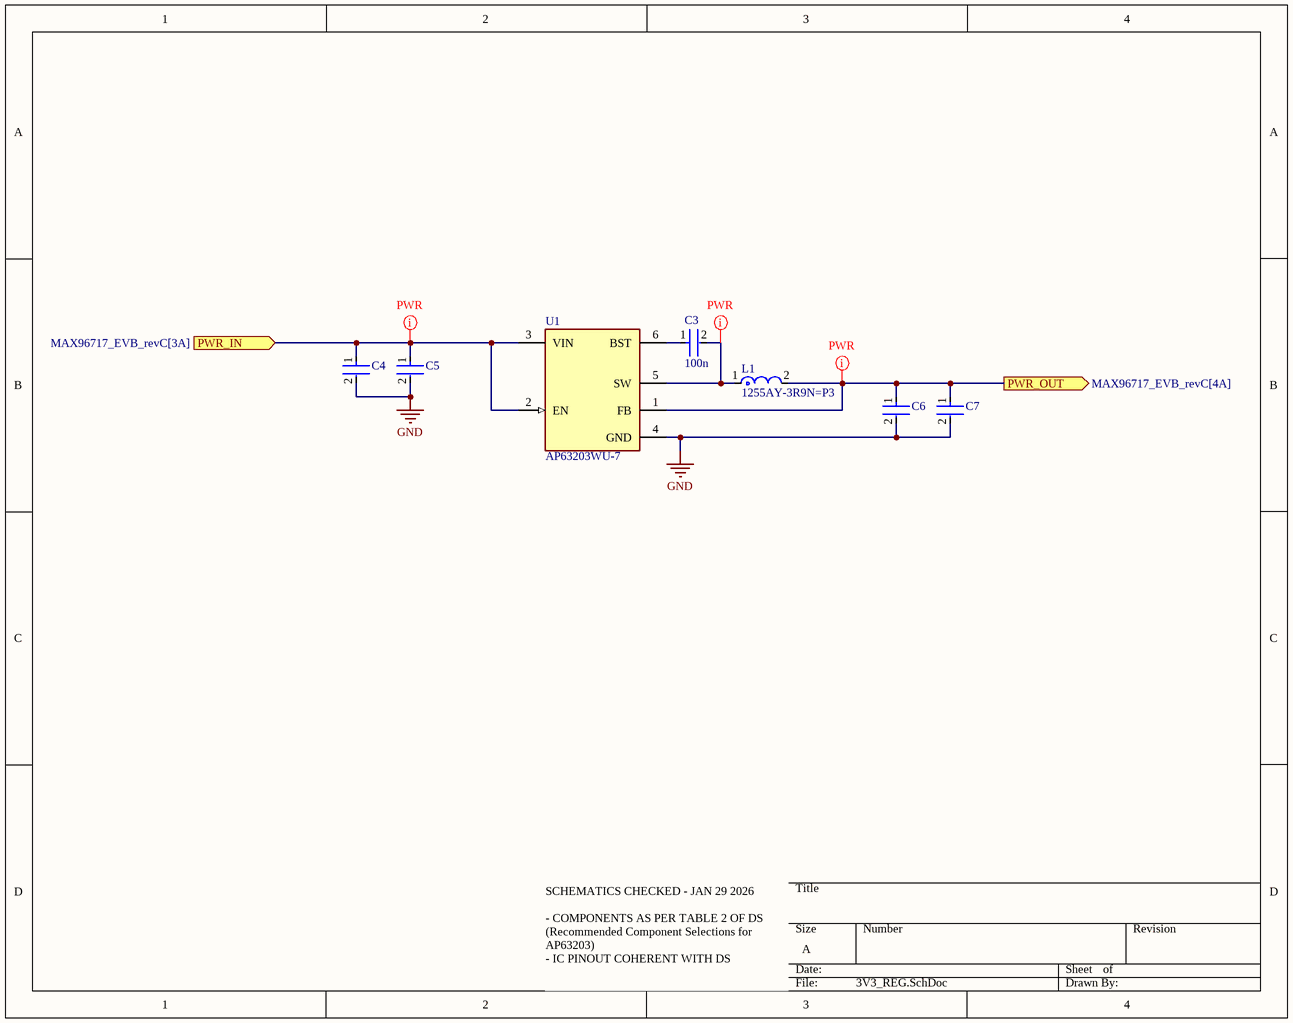
[diagram p3: 3V3_REG.SchDoc]

### Parts
C3  100n  [FP-0402-L_1_0_0_05-W_0_5-IPC_A]
C4  12103D106KAT2A  [FP-1210-L_3_3_0_4-W_2_5_0-MFG]  (value not drawn)
C5  DNP  [FP-1210-L_3_3_0_4-W_2_5_0-MFG]  (value not drawn)
C6  GRM21BR61E226ME44L  [FP-GRM21B-0_2-e0_2_0_7-IPC_B]  (value not drawn)
C7  GRM21BR61E226ME44L  [FP-GRM21B-0_2-e0_2_0_7-IPC_B]  (value not drawn)
L1  1255AY-3R9N=P3  [FP-DG6045C-MFG]
U1  AP63203WU-7  [FP-TSOT26-MFG]

### Ports
PWR_IN (in, see MAX96717_EVB_revC[3A]), PWR_OUT (out, see MAX96717_EVB_revC[4A])

### Nets
3V3: C6.1 C7.1 L1.2 U1.1(FB) ; port PWR_OUT
GND: C4.2 C5.2 C6.2 C7.2 U1.4(GND)
PoC_PWR: C4.1 C5.1 U1.2(EN) U1.3(VIN) ; port PWR_IN
NetC3_1: C3.1 U1.6(BST)
NetC3_2: C3.2 L1.1 U1.5(SW)

### Layout directives
net class PWR: 3V3, NetC3_2, PoC_PWR

### Notes on the sheet
- SCHEMATICS CHECKED - JAN 29 2026
  - COMPONENTS AS PER TABLE 2 OF DS (Recommended Component Selections for AP63203)
  - IC PINOUT COHERENT WITH DS

### Library data of the parts
C3 = CMP-001-00058-1: as C1 on sheet MAX96717_EVB_revC; Min Operating Temperature: -55°C; Mounting Technology: Surface Mount; Pins: 2; Case/Package: 0402; RoHS Compliant: Yes; Max Operating Temperature: 85°C
C4 C5 = CMP-2000-05477-2: General Purpose Ceramic Capacitor, 1210, 10uF, 10%, X5R, 15%, 25V; Lead Free: Lead Free; Max Operating Temperature: 85°C; REACH SVHC: No SVHC; Depth: 2.5mm; Packaging: Tape and Reel; Min Operating Temperature: -55°C; Height: 2.29mm; Construction: Flat; Case Code (Imperial): 1210; Radiation Hardening: No; Voltage: 25V; Case/Package: 1210; Series: -; Dielectric: X5R; Length: 3.2mm; Thickness: 0.11inch; Package Quantity: 1; Termination: SMD/SMT; Case Code (Metric): 3225; Voltage Rating (DC): 25V; Voltage Rating: 25V; Contact Plating: Tin; RoHS Compliant: Yes; Mount: Surface Mount; Width: 0.098inch; Capacitance: 10uF; Tolerance: 10%
C6 C7 = CMP-2007-03222-3: as C15 on sheet MAX96717_PINOUT; Case/Package: 0805; Depth: 1.25mm; Resistor Type: Ceramic; Voltage Rating: 25V; Lead Free: Lead Free; Voltage Rating (DC): 25V; Case Code (Metric): 2012; Thickness: 0.057inch; REACH SVHC: No SVHC; Material: Ceramic; Tolerance: 20%; Length: 2mm; Capacitance: 22uF; Case Code (Imperial): 0805; Max Operating Temperature: 85°C; Termination: SMD/SMT; Weight: 0.000335oz; Dielectric: X5R; Packaging: Tape and Reel; Voltage: 25V; Package Quantity: 3000; Height: 1.25mm; Mount: Surface Mount; Width: 1.25mm; Min Operating Temperature: -55°C
L1 = CMP-06042-002684-1: Shielded Wirewound Inductor 3.9uH 30% 4200mA 0.0264Ω SMD; Saturation Current: 4.7A; Test Frequency: 100kHz; Core Material: Ferrite; Current Rating: 4.2A; DC Resistance (DCR): 26.4mR; Inductance: 3.9uH; Resistor Type: Wirewound; Width: 0.248inch; Mount: Surface Mount; Tolerance: 30%; Packaging: Tape and Reel; Max Operating Temperature: 85°C; Shielding: Shielded; Length: 0.248inch; Min Operating Temperature: -40°C; Height - Seated (Max): 0.177inch; Case/Package: Nonstandard
U1 = CMP-12757-000006-1: IC REG BUCK 3.3V 2A TSOT26; Manufacturer: Diodes Inc.; Output Type: Fixed; Min Supply Voltage: 3.8V; Number Of Outputs: 1; Max Junction Temp: +160°C; Nominal Supply Current: 22uA; Standoff Height: 0.01mm; Switching Frequency: 1.1MHz; Max Supply Voltage: 32V; ComponentLink2Description: Datasheet; Device Class L1: Integrated Circuits (ICs); Temperature: to +160°C; Device Class L3: Voltage Regulators - Switching; RoHS: TRUE; Octopart: https://octopart.com/ap63203wu-7-diodes+inc.-98099550; Output Voltage: 3.3V; Lead Free: Yes; ComponentLink2URL: https://www.diodes.com/assets/Datasheets/AP63200-AP63201-AP63203-AP63205.pdf; Digikey Description: IC REG BUCK 3.3V 2A TSOT26; Footprint Url: https://www.diodes.com/assets/Package-Files/TSOT26.pdf; Ambient Temperature Range High: +85°C; Height: 1mm; Automotive: No; Temperature Range High: +160°C; Switching Topology: Buck; Output Current: 2A; Package: TSOT26; Category: IC; Mouser Description: AP63203 Series 3.3 V 2 A SMT Fixed Low IQ Synchronous Buck - TSOT-26; Device Class L2: Power Management ICs; Ambient Temperature Range Low: -40°C; Manufacturer Part Number: AP63203WU-7

## Sheet ADJ_REG.SchDoc
size A; SheetNumber: 3; SheetTotal: 4
Used 2 times, as channels REG_1, REG_2. Parts and nets are listed once, with the designators drawn on the sheet.
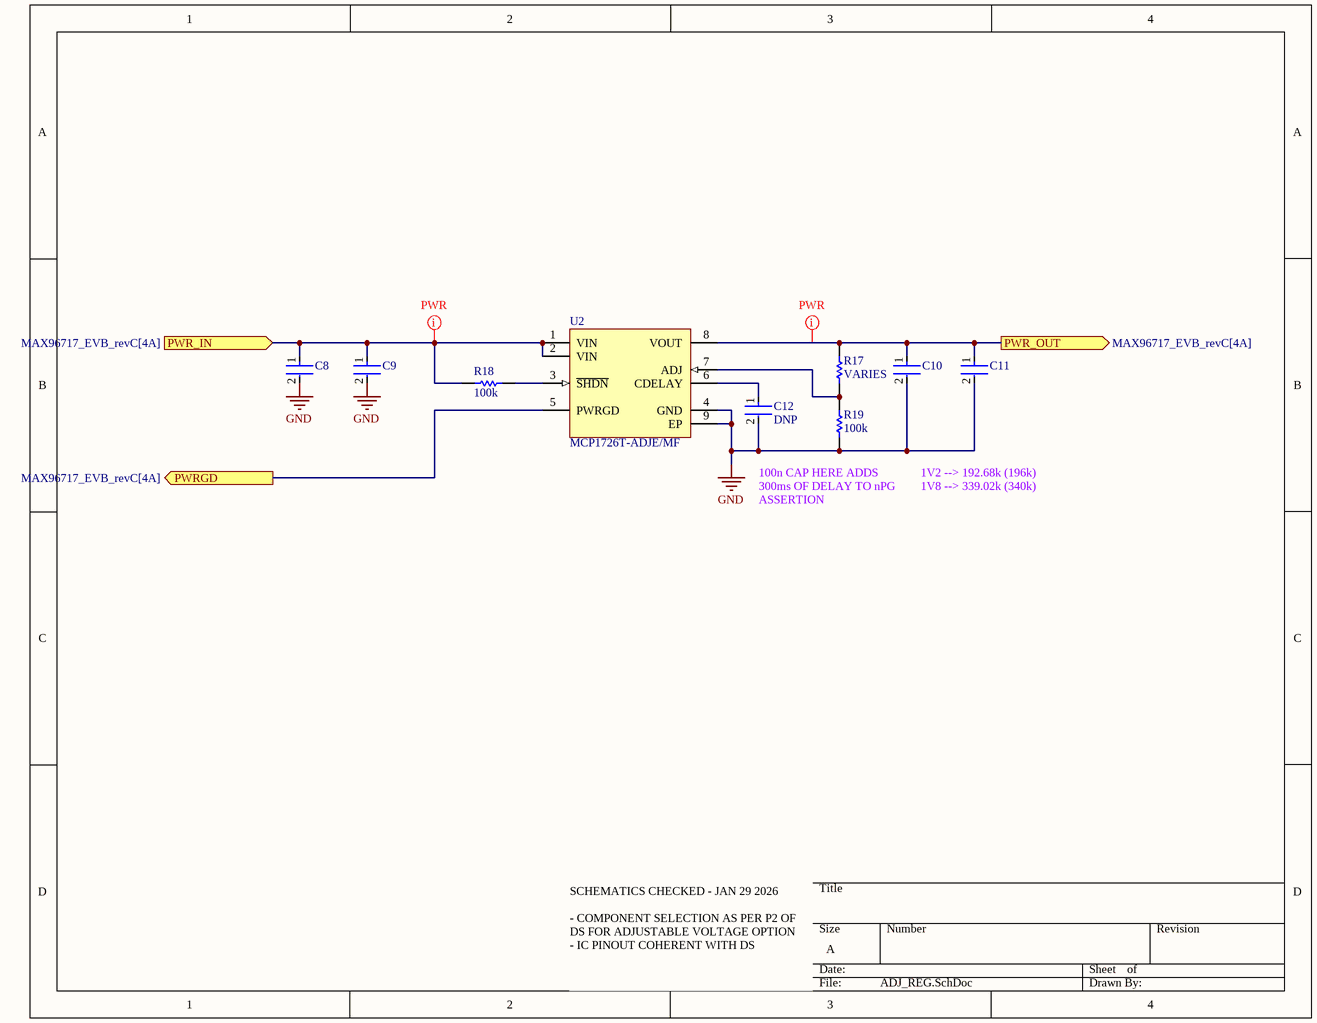
[diagram p4: ADJ_REG.SchDoc]

### Parts
C8  C0805C475J4RACAUTO  [FP-C0805C475J4RACAUTO-MFG]  (value not drawn)
C9  DNP  [FP-C0805C475J4RACAUTO-MFG]  (value not drawn)
C10  HMK325B7105KN-T  [FP-1210-L_3_2_0_3-W_2_5_0-IPC_B]  (value not drawn)
C11  DNP  [FP-1210-L_3_2_0_3-W_2_5_0-IPC_B]  (value not drawn)
C12  DNP  [FP-0402-L_1_0_0_05-W_0_5-IPC_A]
R17  VARIES  [R0603B]
R18  100k  [R0603B]
R19  100k  [R0603B]
U2  MCP1726T-ADJE/MF  [DFN-MF8]

### Ports
PWR_IN (in, see MAX96717_EVB_revC[4A]), PWR_OUT (out, see MAX96717_EVB_revC[4A]), PWRGD (out, see MAX96717_EVB_revC[4A])

### Nets
GND: C8.2 C9.2 C10.2 C11.2 C12.2 R19.1 U2.4(GND) U2.9(EP)
PWR_IN: C8.1 C9.1 R18.1 U2.1(VIN) U2.2(VIN) ; port PWR_IN
PWR_OUT: C10.1 C11.1 R17.2 U2.8(VOUT) ; port PWR_OUT
PWRGD: U2.5(PWRGD) ; port PWRGD
NetC12_1: C12.1 U2.6(CDELAY)
NetR17_1: R17.1 R19.2 U2.7(ADJ)
NetR18_2: R18.2 U2.3(~{SHDN})

### Channels
REG_1: designators end in _REG_1; ports PWR_IN=3V3 PWR_OUT=1V8 PWRGD=NetU2_REG_1_5
REG_2: designators end in _REG_2; ports PWR_IN=3V3 PWR_OUT=1V2 PWRGD=NetU2_REG_2_5

### Layout directives
net class PWR: 1V8, 3V3

### Notes on the sheet
- (near R19) 100n CAP HERE ADDS 300ms OF DELAY TO nPG ASSERTION
- 1V2 --> 192.68k (196k)
  1V8 --> 339.02k (340k)
- SCHEMATICS CHECKED - JAN 29 2026
  - COMPONENT SELECTION AS PER P2 OF DS FOR ADJUSTABLE VOLTAGE OPTION
  - IC PINOUT COHERENT WITH DS

### Library data of the parts
C8 C9 = CMP-00212-84766729-1: C0805C475J4RACAUTO Cap Ceramic 4.7uF 16V X7R 5% Pad SMD 0805 125C Automotive T/R; Capacitance: 4.7µF; Max Operating Temperature: 125°C; Dielectric Material: Ceramic; Voltage Rating (DC): 16V; Dielectric: X7R; Height: 1.4mm; Case/Package: 0805; NexarPartId: 84766729; Voltage Rating: 16V; RoHS: Compliant; Material: Ceramic; Packaging: Cut Tape; Tolerance: 5%; Min Operating Temperature: -55°C
C10 C11 = CMP-14477-002774-2: None; Dielectric: X5R; Capacitance: 1uF; Voltage Rating (DC): 100V; Tolerance: 10%; Length: 3.2mm; Thickness: 0.083inch; Construction: Flat; Width: 2.5mm; Number of Pins: 2; Height: 1.9mm; REACH SVHC: No SVHC; Case Code (Metric): 3225; Termination: SMD/SMT; Packaging: Tape and Reel; Resistor Type: Ceramic; Mount: Surface Mount; Radiation Hardening: No; Case/Package: 1210; Case Code (Imperial): 1210; Min Operating Temperature: -55°C; Max Operating Temperature: 125°C; Halogen Free: Halogen Free; Voltage Rating: 100V; Depth: 2.5mm; Package Quantity: 1; RoHS Compliant: Yes; Voltage: 100V; Series: M
C12 = CMP-001-00058-1: as C1 on sheet MAX96717_EVB_revC; Min Operating Temperature: -55°C; Mounting Technology: Surface Mount; Pins: 2; Case/Package: 0402; RoHS Compliant: Yes; Max Operating Temperature: 85°C
R17-R19 = CMP-009-00002-14: Resistor
  R17: Value: VARIES
  R18 R19: Value: 100k
U2 = CMP-0136-00358-1: 1A, Low Voltage, Low Quiescent Current LDO Regulator, 8-Pin DFN, Extended Temperature, Tape and Reel; DatasheetVersion: revC, Aug-2007; PackageDescription: 8-Lead Plastic Dual Flat, No Lead Package (MF) - 3x3x0.9mm Body [DFN]; PackageVersion: revBB, Aug-2009; PackageReference: DFN-MF8

## Nets that join several sheets
1V2: MAX96717_EVB_revC (J5.1), MAX96717_PINOUT (C22.1 C23.1 C29.1 U3.15), REG_2 (C10_REG_2.1 C11_REG_2.1 R17_REG_2.2 U2_REG_2.8)
1V8: MAX96717_EVB_revC (J4.1 R4.2), MAX96717_PINOUT (C20.1 C21.1 C28.1 U3.11), REG_1 (C10_REG_1.1 C11_REG_1.1 R17_REG_1.2 U2_REG_1.8)
3V3: MAX96717_EVB_revC (11 pins), MAX96717_PINOUT (7 pins), 3V3_REG (C6.1 C7.1 L1.2 U1.1), REG_1 (5 pins), REG_2 (5 pins)
GND: MAX96717_EVB_revC (57 pins), MAX96717_PINOUT (22 pins), 3V3_REG (5 pins), REG_1 (8 pins), REG_2 (8 pins)
PoC_PWR: MAX96717_EVB_revC (7 pins), 3V3_REG (C4.1 C5.1 U1.2 U1.3)
3V3_LOCK: MAX96717_EVB_revC (P5.6 R11.2), MAX96717_PINOUT (U3.31)
3V3_MFP0: MAX96717_EVB_revC (P3.2 P5.1), MAX96717_PINOUT (U3.2)
3V3_MFP3: MAX96717_EVB_revC (D2.1 P5.2 R2.1 R6.2), MAX96717_PINOUT (U3.17)
3V3_MFP4: MAX96717_EVB_revC (P5.3), MAX96717_PINOUT (U3.18)
3V3_MFP5: MAX96717_EVB_revC (D3.1 P5.4 R3.1 R7.2), MAX96717_PINOUT (U3.21)
3V3_MFP6: MAX96717_EVB_revC (D4.1 P5.5 R4.1 R8.2), MAX96717_PINOUT (U3.22)
3V3_nERRB: MAX96717_EVB_revC (P5.7 R15.1), MAX96717_PINOUT (U3.32)
3V3_nPWDN: MAX96717_EVB_revC (P4.1), MAX96717_PINOUT (R25.1 U3.1)
3V3_SER_I2C_SCL: MAX96717_EVB_revC (J11.1 P2.2 R10.1), MAX96717_PINOUT (U3.6)
3V3_SER_I2C_SDA: MAX96717_EVB_revC (J10.1 P1.2 R9.1), MAX96717_PINOUT (U3.5)
CSI_CK_N: MAX96717_EVB_revC (J8.8), MAX96717_PINOUT (U3.28)
CSI_CK_P: MAX96717_EVB_revC (J8.9), MAX96717_PINOUT (U3.27)
CSI_D0_N: MAX96717_EVB_revC (J8.2), MAX96717_PINOUT (U3.26)
CSI_D0_P: MAX96717_EVB_revC (J8.3), MAX96717_PINOUT (U3.25)
CSI_D1_N: MAX96717_EVB_revC (J8.5), MAX96717_PINOUT (U3.30)
CSI_D1_P: MAX96717_EVB_revC (J8.6), MAX96717_PINOUT (U3.29)
NetF2_1: MAX96717_EVB_revC (F2.1), MAX96717_PINOUT (L4.1)
RF_OUT: MAX96717_EVB_revC (J9.1), MAX96717_PINOUT (C13.2 L3.2)